# EasyEDA Pro project ProPrj_大功率电调_2026-08-17.epro, board 主控板V1.1
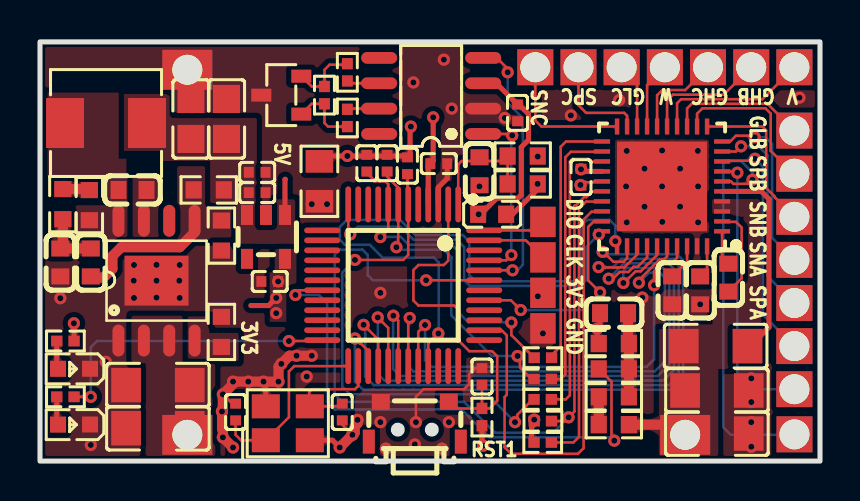
[diagram p21: board, top side]
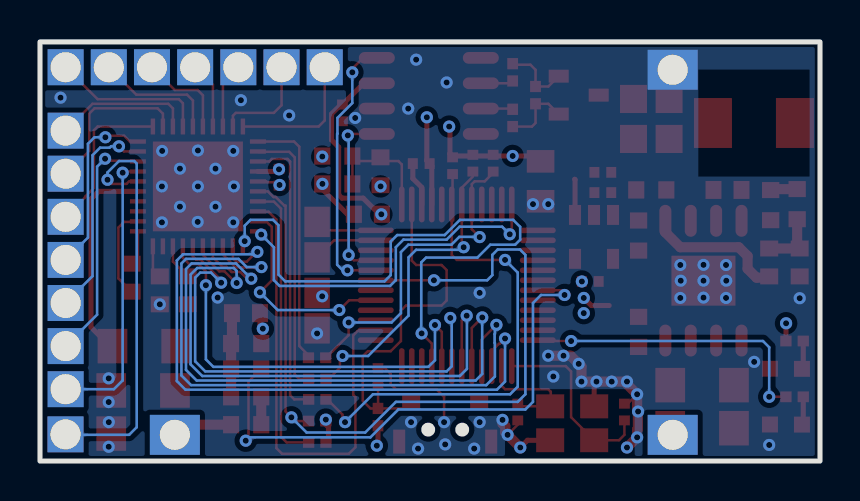
[diagram p22: board, bottom side, seen from below]

Outline 39 x 21 mm; copper layers: Top Layer, Inner1, Inner2, Bottom Layer. Coordinates in mm from the lower left corner of the outline.
Outline path: rectangle 39,21 0,0
Stack: Top Layer 0.035mm Outer layer thickness 1oz / Dielectric1 0.2104mm 7628 RC49% 8.6mil / Inner1 0.0152mm Inner layer thickness / Dielectric2 1.065mm 1.1mm H/HOZ Copper / Inner2 0.0152mm Inner layer thickness / Dielectric3 0.2104mm 7628 RC49% 8.6mil / Bottom Layer 0.035mm Outer layer thickness 1oz

## Design rules (mm)
spacing copperThickness1oz (default): track to track 0.102, other pairs 0.152 to 0.3
spacing copperThickness2oz: track to track 0.203, other pairs 0.152 to 0.3
track width copperThickness1oz (default): min 0.127, default 0.127, max 2.54
track width copperThickness2oz: min 0.203, default 0.254, max 2.54
differential pair differentialPair (default): width min 0.127, default 0.254, max 2.54; gap min 0.152, default 0.152
net VCC_BUS uses copperRegion
net GND uses copperRegion
net $3N8 uses copperRegion
net $3N9 uses copperRegion
net 5V uses copperRegion
net FB uses copperRegion
net 3V3 uses copperRegion
net 3V3_A uses copperRegion
net $1N26 uses copperRegion
net $3N14 uses copperRegion
net VBUS_ADC uses copperRegion

## Placement (name value [footprint] x y rotation side)
C1  47nf  [C0603]  34.42 9.19 90 top
C2  10uF/100v  [C1206]  33.85 1.38 180 top
C3  100nF/100v  [C1206]  33.85 3.54 180 top
C4  1uF  [C1206]  33.78 5.76 0 top
C5  1uf  [C0603]  33.01 8.55 270 top
C6  1uf  [C0603]  31.61 8.55 270 top
C7  1nF  [C0402]  16.34 14.92 270 top
C8  1nF  [C0402]  17.36 14.92 270 top
C9  1nF  [C0402]  18.37 14.8 270 top
C10  2.2nF/50v  [C0603]  4.63 13.58 180 top
C11  22µF/16V  [C0805]  9.33 17.14 270 top
C12  22µF/16V  [C0805]  7.55 17.14 270 top
C13  2.2uf/100v  [C1206]  5.9 3.8 0 top
C14  100nF/100v  [C1206]  5.9 1.65 0 top
C15  3.3nf/50v  [C0603]  1.02 9.95 90 top
C16  56pf/50v  [C0603]  2.54 9.95 90 top
C17  1uF  [C0402]  10.86 14.47 180 top
C18  100nF  [C0402]  10.86 13.45 180 top
C19  1uF  [C0402]  11.49 9 0 top
C20  20pf  [C0402]  9.78 2.46 90 top
C21  100nF  [C0402]  19.94 14.9 180 top
C22  100nF  [C0402]  27.05 14.22 90 top
C28  20pf  [C0402]  15.11 2.46 270 top
C29  100nF  [C0402]  22.1 4.24 270 top
C30  100nF  [C0402]  23.88 17.44 270 top
C32  10nF  [C0603]  28.7 7.41 0 top
C33  100nF  [C0603]  21.98 14.52 90 top
D1  PESD2CAN,215  [SOT-23-3_L2.9-W1.3-P1.90-LS2.4-BR]  12.06 18.33 0 top
L1  33uH  [IND-SMD_L5.4-W5.2]  3.3 16.94 180 top
L2  BLM18PG121SN1D  [L0603]  22.61 12.36 0 top
LED1  -  [LED_0603]  1.65 4.62 180 top
LED2  -  [LED_0603]  1.65 1.82 180 top
NOREF  -  [Pad_e250]  7.37 1.31 90 top
NOREF#2  -  [Pad_e253]  24.77 19.73 90 top
NOREF#3  -  [Pad_e255]  29.08 19.73 90 top
NOREF#4  -  [Pad_e696]  32.26 1.31 90 top
NOREF#5  -  [Pad_e260]  37.72 14.4 180 top
NOREF#6  -  [Pad_e257]  33.4 19.73 90 top
NOREF#7  -  [Pad_e258]  35.56 19.73 90 top
NOREF#8  -  [Pad_e262]  37.72 16.55 180 top
NOREF#9  -  [Pad_e264]  37.72 7.92 180 top
NOREF#10  -  [Pad_e907]  25.15 10.2 270 top
NOREF#11  -  [Pad_e247]  7.37 19.6 270 top
NOREF#12  -  [Pad_e254]  26.92 19.73 90 top
NOREF#13  -  [Pad_e265]  37.72 5.76 180 top
NOREF#14  -  [Pad_e888]  25.15 11.98 270 top
NOREF#15  -  [Pad_e263]  37.72 10.08 180 top
NOREF#16  -  [Pad_e256]  31.24 19.73 90 top
NOREF#17  -  [Pad_e261]  37.72 12.24 180 top
NOREF#18  -  [Pad_e259]  37.72 19.73 90 top
NOREF#19  -  [Pad_e266]  37.72 3.6 180 top
NOREF#20  -  [Pad_e935]  25.15 8.43 270 top
NOREF#21  -  [Pad_e267]  37.72 1.34 180 top
NOREF#22  -  [Pad_e941]  25.15 6.65 270 top
R1  10K  [R0402]  22.1 2.2 90 top
R2  5.1  [R0402]  15.37 17.19 270 top
R3  5.1  [R0402]  15.37 19.48 90 top
R4  120  [R0402]  14.22 18.33 270 top
R5  0  [R0805]  13.97 14.02 270 top
R6  10K  [R0402]  1.27 6.01 180 top
R7  10K  [R0402]  1.27 3.22 180 top
R28  10K  [R0402]  25.14 0.93 0 top
R29  10K  [R0402]  25.14 2 0 top
R30  100  [R0402]  25.14 3.09 0 top
R31  100  [R0402]  25.14 4.11 0 top
R32  100  [R0402]  25.15 5.18 0 top
R33  68K  [R0603]  2.47 12.82 90 top
R34  158k  [R0603]  8.44 13.58 0 top
R35  68K  [R0603]  1.14 12.87 90 top
R36  49.9k  [R0603]  9.07 11.3 90 top
R37  31.6k  [R0603]  9.07 6.47 270 top
R43  100  [R0603]  28.69 4.62 180 top
R47  330K  [R0603]  28.69 1.82 180 top
R48  330K  [R0603]  28.69 3.22 0 top
R49  36K  [R0603]  28.69 5.89 180 top
R51  10k  [R0603]  24.14 13.88 180 top
R52  HNTC0603-103F3950FB  [R0603]  24.14 15.28 0 top
RST1  侧按侧贴开关  [KEY-SMD_1TS003B]  18.74 1.98 0 top
U1  DRV8353SRTAR  [WQFN-40_L6.0-W6.0-P0.50-TL-EP4.5]  31.1 13.76 180 top
U2  LKS32MC071CBT8  [TQFP-48_L7.0-W7.0-P0.50-LS9.0-BL]  18.16 8.81 180 top
U3  LM5164DDAR  [SO-8_L4.9-W3.9-P1.27-LS6.0-BL-EP]  5.83 9.04 0 top
U4  SPX3819-3.3  [SOT-23-5_L2.9-W1.6-P0.95-LS2.8-BL]  11.3 11.23 180 top
U7  TCAN332DR  [SOIC-8_L4.9-W3.9-P1.27-LS6.0-BL]  19.56 18.29 90 top
X1  8MHz  [CRYSTAL-SMD_4P-L3.2-W2.5-BL]  12.39 1.89 0 top

## Footprints (pads in the part's own frame, mm; a bottom-side part is the same pattern mirrored in y, then rotated)
C0402
  rect 0.5x0.54 smd: 1(-0.42,0) 2(0.42,0)
C0603
  rect 0.8x0.9 smd: 1(-0.7,0) 2(0.7,0)
C0805
  rect 1.41x1.35 smd: 1(-1,0) 2(1,0)
C1206
  rect 1.485x1.728 smd: 1(-1.593,0) 2(1.593,0)
CRYSTAL-SMD_4P-L3.2-W2.5-BL
  rect 1.4x1.2 smd: 1(-1.1,-0.85) 2(1.1,-0.85) 3(1.1,0.85) 4(-1.1,0.85)
IND-SMD_L5.4-W5.2
  rect 1.9x2.5 smd: 1(2.05,0) 2(-2.05,0)
KEY-SMD_1TS003B
  rect 0.9x0.8 smd: 1(1.7,1) 2(-1.7,1)
  rect 0.6x1.2 smd: 3(-2.3,-1) 4(2.3,-1)
L0603
  rect 0.8x0.864 smd: 1(-0.7,0) 2(0.7,0)
LED_0603
  rect 0.8x0.8 smd: 1(-0.851,-0.01) 2(0.75,-0.005)
Pad_e247
  rect 2x2.5 hole 1.5: 1(0,0)
Pad_e250
  rect 2x2.5 hole 1.5: 1(0,0)
Pad_e253
  rect 1.8x1.8 hole 1.5: 1(0,0)
Pad_e254
  rect 1.8x1.8 hole 1.5: 1(0,0)
Pad_e255
  rect 1.8x1.8 hole 1.5: 1(0,0)
Pad_e256
  rect 1.8x1.8 hole 1.5: 1(0,0)
Pad_e257
  rect 1.8x1.8 hole 1.5: 1(0,0)
Pad_e258
  rect 1.8x1.8 hole 1.5: 1(0,0)
Pad_e259
  rect 1.8x1.8 hole 1.5: 1(0,0)
Pad_e260
  rect 1.8x1.8 hole 1.5: 1(0,0)
Pad_e261
  rect 1.8x1.8 hole 1.5: 1(0,0)
Pad_e262
  rect 1.8x1.8 hole 1.5: 1(0,0)
Pad_e263
  rect 1.8x1.8 hole 1.5: 1(0,0)
Pad_e264
  rect 1.8x1.8 hole 1.5: 1(0,0)
Pad_e265
  rect 1.8x1.8 hole 1.5: 1(0,0)
Pad_e266
  rect 1.8x1.8 hole 1.5: 1(0,0)
Pad_e267
  rect 1.8x1.8 hole 1.5: 1(0,0)
Pad_e696
  rect 2x2.5 hole 1.5: 1(0,0)
Pad_e888
  rect 1.524x1.27 smd: 1(0,0)
Pad_e907
  rect 1.524x1.27 smd: 1(0,0)
Pad_e935
  rect 1.524x1.27 smd: 1(0,0)
Pad_e941
  rect 1.524x1.27 smd: 1(0,0)
R0402
  rect 0.566x0.54 smd: 1(-0.433,0) 2(0.433,0)
R0603
  rect 0.806x0.864 smd: 1(-0.753,0) 2(0.753,0)
R0805
  rect 1.133x1.377 smd: 1(-1,0) 2(1,0)
SO-8_L4.9-W3.9-P1.27-LS6.0-BL-EP
  oval 0.6x1.6 smd: 1(-1.905,-3) 2(-0.635,-3) 3(0.635,-3) 4(1.905,-3) 5(1.905,3) 6(0.635,3) 7(-0.635,3) 8(-1.905,3)
  rect 3.2x2.5 smd: 9(0,0)
SOIC-8_L4.9-W3.9-P1.27-LS6.0-BL
  oval 0.588x1.8 smd: 1(-1.905,-2.6) 2(-0.635,-2.6) 3(0.635,-2.6) 4(1.905,-2.6) 5(1.905,2.6) 6(0.635,2.6) 7(-0.635,2.6) 8(-1.905,2.6)
SOT-23-3_L2.9-W1.3-P1.90-LS2.4-BR
  rect 1x0.65 smd: 1(1,-0.95) 2(1,0.95) 3(-1,0)
SOT-23-5_L2.9-W1.6-P0.95-LS2.8-BL
  rect 0.6x1 smd: 1(-0.95,-1.1) 2(0,-1.1) 3(0.95,-1.1) 4(0.95,1.1) 5(-0.95,1.1)
TQFP-48_L7.0-W7.0-P0.50-LS9.0-BL
  oval 0.28x1.8 smd: 1(-2.75,-4.05) 2(-2.25,-4.05) 3(-1.75,-4.05) 4(-1.25,-4.05) 5(-0.75,-4.05) 6(-0.25,-4.05) 7(0.25,-4.05) 8(0.75,-4.05) 9(1.25,-4.05) 10(1.75,-4.05) 11(2.25,-4.05) 12(2.75,-4.05) 25(2.75,4.05) 26(2.25,4.05) 27(1.75,4.05) 28(1.25,4.05) 29(0.75,4.05) 30(0.25,4.05) 31(-0.25,4.05) 32(-0.75,4.05) 33(-1.25,4.05) 34(-1.75,4.05) 35(-2.25,4.05) 36(-2.75,4.05)
  oval 1.8x0.28 smd: 13(4.05,-2.75) 14(4.05,-2.25) 15(4.05,-1.75) 16(4.05,-1.25) 17(4.05,-0.75) 18(4.05,-0.25) 19(4.05,0.25) 20(4.05,0.75) 21(4.05,1.25) 22(4.05,1.75) 23(4.05,2.25) 24(4.05,2.75) 37(-4.05,2.75) 38(-4.05,2.25) 39(-4.05,1.75) 40(-4.05,1.25) 41(-4.05,0.75) 42(-4.05,0.25) 43(-4.05,-0.25) 44(-4.05,-0.75) 45(-4.05,-1.25) 46(-4.05,-1.75) 47(-4.05,-2.25) 48(-4.05,-2.75)
WQFN-40_L6.0-W6.0-P0.50-TL-EP4.5
  rect 0.8x0.22 smd: 1(-3,2.25) 2(-3,1.75) 3(-3,1.25) 4(-3,0.75) 5(-3,0.25) 6(-3,-0.25) 7(-3,-0.75) 8(-3,-1.25) 9(-3,-1.75) 10(-3,-2.25) 21(3,-2.25) 22(3,-1.75) 23(3,-1.25) 24(3,-0.75) 25(3,-0.25) 26(3,0.25) 27(3,0.75) 28(3,1.25) 29(3,1.75) 30(3,2.25)
  rect 0.22x0.8 smd: 11(-2.25,-3) 12(-1.75,-3) 13(-1.25,-3) 14(-0.75,-3) 15(-0.25,-3) 16(0.25,-3) 17(0.75,-3) 18(1.25,-3) 19(1.75,-3) 20(2.25,-3) 31(2.25,3) 32(1.75,3) 33(1.25,3) 34(0.75,3) 35(0.25,3) 36(-0.25,3) 37(-0.75,3) 38(-1.25,3) 39(-1.75,3) 40(-2.25,3)
  rect 4.5x4.5 smd: 41(0,0)

## Nets
3V3: C19.2 C30.1 L2.1 NOREF#20.1 R1.1 R6.1 R28.1 R29.1 U4.5 U7.3
3V3_A: C21.2 C22.2 L2.2 R51.1 U1.24 U2.4
5V: C11.2 C12.2 C17.2 C18.2 L1.2 R34.2 U4.1 U4.3
AGND: C7.1 C8.1 C9.1 C22.1 C32.1 C33.1 R5.1 R49.2 R52.2 U1.25
GND: C2.1 C3.1 C5.2 C6.2 C11.1 C12.1 C13.1 C14.1 C15.1 C17.1 C18.1 C19.1 C20.2 C21.1 C28.2 C29.1 C30.2 D1.3 LED1.1 LED2.1 NOREF#11.1 NOREF#22.1 R5.2 R36.1 R37.1 RST1.2 U1.39 U1.41 U2.3 U3.1 U3.9 U4.2 U7.2 X1.2 X1.4
PVCC_BUS: C2.2 C3.2 C4.1 NOREF#4.1 R47.1 U1.3 U1.4
VBUS_ADC: R43.2 U2.19
VCC_BUS: C13.2 C14.2 NOREF.1 U3.2 U3.3
CANH: D1.1 R2.2 R4.2
CANL: D1.2 R3.2 R4.1
ENABLE: U1.31 U2.33
FB: C16.1 R34.1 R36.2 U3.5
GHA: NOREF#21.1 U1.6
GHB: NOREF#7.1 U1.15
GHC: NOREF#6.1 U1.16
GLA: NOREF#13.1 U1.8
GLB: NOREF#8.1 U1.13
GLC: NOREF#3.1 U1.18
INHA: U1.32 U2.27
INHB: U1.34 U2.29
INHC: U1.36 U2.31
INLA: U1.33 U2.28
INLB: U1.35 U2.30
INLC: U1.37 U2.32
LED: R7.1 U2.24
nFAULT: R29.2 U1.26 U2.43
NRST: C29.2 R1.2 RST1.1 U2.2
nSCS: U1.30 U2.12
NTC_ADC: C33.2 R51.2 R52.1 U2.1
OSC_IN: C20.1 U2.25 X1.1
OSC_OUT: C28.1 U2.26 X1.3
RAMP_NODE: C15.2 C16.2 R35.1
RXD: U2.44 U7.4
SCLK: U1.29 U2.41
SD0: U2.37
SDI: U1.28 U2.38
SDO: R28.2 U1.27
SNA: NOREF#15.1 U1.10
SNB: NOREF#17.1 U1.11
SNC: NOREF#2.1 U1.20
SOA: C9.2 R30.1 U2.6
SOB: C8.2 R31.1 U2.7
SOC: C7.2 R32.1 U2.8
SPA: NOREF#9.1 U1.9
SPB: NOREF#5.1 U1.12
SPC: NOREF#12.1 U1.19
SWCLK: NOREF#10.1 U2.47
SWDIO: NOREF#14.1 U2.48
TXD: U2.45 U7.1
U: NOREF#19.1 U1.7
V: NOREF#18.1 U1.14
W: NOREF#16.1 U1.17
$1N4: LED2.2 R7.2
$1N5: LED1.2 R6.2
$1N19: R2.1 U7.7
$1N20: R3.1 U7.6
$1N26: C32.2 R43.1 R48.2 R49.1
$1N27: R47.2 R48.1
$2N6: C6.1 U1.38
$2N8: C5.1 U1.40
$2N26: R32.2 U1.21
$2N27: R31.2 U1.22
$2N28: R30.2 U1.23
$2N30: C4.2 U1.5
$2N42: C1.1 U1.2
$2N43: C1.2 U1.1
$3N3: R33.2 R35.2
$3N8: C10.2 L1.1 R33.1 U3.8
$3N9: C10.1 U3.7
$3N14: R37.2 U3.4

Pads without a net: RST1 3 4; U2 5 9 10 11 13 14 15 16 17 18 20 21 22 23 34 35 36 39 40 42 46; U3 6; U4 4; U7 5 8

## Via types
v1: diameter 0.61, hole 0.305, Top Layer to Bottom Layer, 119 vias

## Routing (per net, layer and track width the routed paths; a pad name or vN(x,y) marks a point on that pad's centre or on a via; arc(x,y) is an arc through that point)
3V3: length 58
  Top Layer w0.127: 24.58,1.69 24.58,1.94 v1(24.71,2.08)
  Top Layer w0.254: 10.54,7.79 11.43,7.79 v1(11.81,8.17) ; 24.58,0.93 24.58,1.69 24.71,1.83 v1(24.71,2.08) ; R1.1 22.1,0.83 v1(22.16,0.77) ; 22.03,12.36 22.84,13.17 23.9,13.17 24.06,13.33 24.06,15.73 24.43,16.09 24.43,17.39 23.95,17.86 C30.1 22.81,18.93 U7.3 ; v1(1.7,6.9) 1.7,6.9 1.7,6.01
  Inner2 w0.254: 22.16,11.22 22.16,8.21 ; 22.16,8.21 22.16,3.6 ; 22.16,8.21 24.85,8.21 v1(24.89,8.25) ; v1(24.71,2.08) 24.71,3.02 24.13,3.6 22.16,3.6 ; 22.16,3.6 v1(22.16,0.77) ; v1(21.93,12.36) 22.16,12.14 22.16,11.22 19.94,11.22 19.22,11.94 12.15,11.94 11.81,11.6 v1(11.81,8.17) v1(11.81,7.41) 2.2,7.41 v1(1.7,6.9)
  vias: v1(11.91,9)
3V3_A: length 23.3
  Top Layer w0.254: R51.1 24.89,13.88 24.89,13.63 23.63,12.36 23.43,12.36 ; v1(27.05,14.62) 27.16,14.51 U1.24 ; v1(19.66,17.22) 19.66,15.04 C21.2 19.41,14.8 U2.4
  Inner2 w0.254: v1(24.88,13.89) 25.61,14.62 v1(27.05,14.62) 27.06,14.6 27.81,14.6 28.07,14.86 28.07,17.65 27.77,17.95 22.48,17.95 21.46,16.94 19.95,16.94 v1(19.66,17.22)
5V: length 1.8
  Top Layer w0.254: U4.1 12.25,14.1 12.27,14.12
AGND: length 9.1
  Top Layer w0.127: 24.89,15.03 24.89,15.03 v1(24.89,15.25) ; v1(27.02,13.83) 27.16,13.97 27.65,13.97 27.69,14.01 U1.25
  Top Layer w0.254: C32.1 28,6.78 v1(27.86,6.63) 27.86,5.97 R49.2 ; 18.37,15.28 v1(15.37,15.28) 14.24,15.28 R5.1 ; 18.5,16.77 18.5,15.4 18.37,15.27
  vias: v1(18.54,16.76) v1(21.97,13.76)
GND: length 22.7
  Top Layer w0.127: v1(9.14,3.35) 9.61,2.88 C20.2 ; C28.2 15.11,1.82 v1(15.62,1.31) ; C29.1 21.76,4.66 21.46,4.36 21.46,3.85 21.21,3.6 19.18,3.6 18.8,3.22 v1(18.8,1.95)
  Top Layer w0.254: 20.36,14.9 20.36,14.16 19.91,13.71 U2.3 ; v1(14.99,0.68) 14.62,1.04 13.49,1.04 ; 11.29,2.74 11.29,3.87 v1(11.18,3.98)
  Top Layer w0.508: v1(15.88,2.06) 15.88,1.88 15.74,1.74 15.74,1.43 v1(15.62,1.31) v1(14.99,0.68) ; v1(9.65,0.68) v1(9.14,1.19) 9.14,1.58 9.1,1.62 9.1,2.46 9.14,2.5 v1(9.14,3.35) 9.78,3.98 v1(10.41,3.98) v1(11.18,3.98) v1(11.93,3.98) 11.93,4.73 v1(12.06,4.87) 12.47,5.28 v1(12.83,5.28) v1(13.59,5.28)
  vias: v1(1.02,8.16) v1(2.54,0.81) v1(3.29,4.97) v1(4.7,9.82) v1(4.69,9.04) v1(4.7,8.17) v1(5.83,9.83) v1(5.83,9.04) v1(5.83,8.19) v1(6.99,9.82) v1(6.96,9.04) v1(6.99,8.17) v1(9.1,2.48) v1(9.65,3.98) v1(13.34,4.24) v1(13.59,12.87) v1(14.35,12.87) v1(17.02,8.43) v1(17.02,1.95) v1(17.29,0.63) v1(18.67,18.97) v1(18.74,0.83) v1(20.1,0.63) v1(20.19,20.11) v1(20.45,1.95) v1(20.59,17.66) v1(23.24,17.19) v1(25.15,6.39) v1(26.54,17.32) v1(28.96,18.08) v1(29.34,15.54) v1(29.3,13.76) v1(29.34,11.96) v1(30.12,8.19) v1(30.23,14.65) v1(30.23,12.74) v1(31.1,15.56) v1(31.1,13.76) v1(31.12,11.98) v1(32,14.65) v1(32,12.74) v1(32.89,15.54) v1(32.9,13.76) v1(32.9,11.96) v1(33.01,7.85) v1(35.56,4.14) v1(35.56,2.96) v1(35.56,1.95) v1(35.56,0.72) v1(37.97,18.21)
PVCC_BUS: length 3.1
  Top Layer w0.508: 32.38,1.38 31.94,1.82 R47.1
VBUS_ADC: length 27.2
  Top Layer w0.127: v1(28.71,1.02) 28.58,1.16 28.58,3.98 R43.2 ; v1(12.77,8.32) 12.77,8.37 12.96,8.56 U2.19
  Bottom Layer w0.127: v1(28.71,1.02) 28.55,1.19 22.48,1.19 21.08,2.58 14.73,2.58 14.35,2.97 14.35,7.92 13.95,8.32 v1(12.77,8.32)
CANH: length 3.6
  Top Layer w0.127: R2.2 14.4,16.76 14.22,16.94 R4.2 13.58,17.9 D1.1
CANL: length 3.5
  Top Layer w0.127: 15.37,19.91 15.32,19.86 14.48,19.86 14.22,19.6 R4.1 13.58,18.77 D1.2
ENABLE: length 31.3
  Top Layer w0.127: U2.33 19.41,5.89 v1(19.92,6.39)
  Bottom Layer w0.127: v1(19.92,6.39) 19.94,6.41 19.94,9.95 19.7,10.19 17.13,10.19 16.48,10.84 15.24,10.84 14.99,11.09 14.99,11.73 15.34,12.08 18,12.08 18.76,11.32 21.14,11.32 21.46,11 21.46,9.32 21.77,9 26.74,9 27.08,9.34 27.08,11.81 27.35,12.08 28.47,12.08 28.77,11.79 v1(28.77,11.02)
FB: length 7.1
  Top Layer w0.508: C16.1 2.6,9.19 3.18,9.19 3.62,9.63 3.62,10.27 4.06,10.71 6.99,10.71 7.73,11.46 U3.5
GHA: length 20.7
  Top Layer w0.127: U1.6 34.55,14.01 34.67,13.89 35.42,13.89 v1(35.62,14.09)
  Bottom Layer w0.127: v1(35.62,14.09) 35.62,14.46 35.05,15.03 34.29,15.03 34.16,14.9 34.16,1.7 34.54,1.31 37.7,1.31 NOREF#21.1
GHB: length 6.2
  Top Layer w0.127: U1.15 31.35,18.06 31.65,18.36 34.19,18.36 NOREF#7.1
GHC: length 4.7
  Top Layer w0.127: NOREF#6.1 32.26,18.59 31.12,18.59 30.85,18.33 U1.16
GLA: length 11.9
  Top Layer w0.127: U1.8 34.13,14.99 34.33,14.99 34.39,15.05 35.65,15.05 v1(35.75,15.15)
  Bottom Layer w0.127: NOREF#13.1 36.15,7.33 36.15,14.75 v1(35.75,15.15)
GLB: length 6.9
  Top Layer w0.127: NOREF#8.1 36.37,17.9 32.59,17.9 32.35,17.67 U1.13
GLC: length 3.3
  Top Layer w0.127: NOREF#3.1 29.85,18.96 U1.18
INHA: length 32.9
  Top Layer w0.127: U2.27 16.41,5.52 16.06,5.87 16.02,5.87 v1(15.75,6.14) ; U1.32 29.35,10.16 29.18,9.99 28.67,9.99 28.17,10.48 v1(28.13,10.48)
  Bottom Layer w0.127: v1(15.75,6.14) 15.75,3.98 16.15,3.58 31.72,3.58 32.16,4.01 32.16,10.05 31.85,10.36 28.34,10.36 28.22,10.48 v1(28.13,10.48)
INHB: length 32.3
  Top Layer w0.127: U1.34 30.35,10.21 29.88,9.73 29.68,9.73 29.42,9.47 28.98,9.47 28.65,9.14 v1(28.44,9.14) ; U2.29 17.41,6.67 v1(16.89,7.2)
  Bottom Layer w0.127: v1(28.44,9.14) 29.2,9.9 31.42,9.9 31.7,9.62 31.7,4.57 31.17,4.03 17.22,4.03 16.89,4.36 16.89,7.19 v1(16.89,7.2)
INHC: length 26.4
  Top Layer w0.127: U2.31 18.41,7.1 v1(18.49,7.17) ; v1(29.94,8.94) 29.94,9.06 30.98,10.1 31.19,10.1 31.35,10.26 U1.36
  Bottom Layer w0.127: v1(18.49,7.17) 18.41,7.1 18.41,4.74 18.67,4.49 30.74,4.49 31.24,5 31.24,9.19 30.99,9.44 30.45,9.44 v1(29.94,8.94)
INLA: length 33.6
  Top Layer w0.127: v1(27.93,9.72) 27.95,9.7 28.88,9.7 28.89,9.7 29.22,9.7 29.85,10.34 U1.33 ; v1(16.18,6.83) 16.91,6.09 U2.28
  Bottom Layer w0.127: v1(16.18,6.83) 16.26,6.75 16.26,6.37 16.27,6.36 16.27,5.92 16.26,5.91 16.26,4.24 16.69,3.8 31.45,3.8 31.93,4.29 31.93,9.9 31.7,10.13 29.07,10.13 28.66,9.72 v1(27.93,9.72)
INLB: length 29.8
  Top Layer w0.127: U2.30 17.91,7.04 v1(17.67,7.28) ; v1(29.17,8.92) 29.19,8.92 29.78,9.5 30.03,9.5 30.85,10.32 U1.35
  Bottom Layer w0.127: v1(17.67,7.28) 17.65,7.27 17.65,4.62 18.01,4.26 30.89,4.26 31.47,4.85 31.47,9.34 31.14,9.67 29.31,9.67 29.17,9.53 v1(29.17,8.92)
INLC: length 22.1
  Top Layer w0.127: U1.37 31.85,10.18 31.54,9.87 31.07,9.87 30.71,9.5 v1(30.71,8.81) ; U2.32 18.91,6.48 v1(19.25,6.82)
  Bottom Layer w0.127: v1(19.25,6.82) 19.25,5.05 19.58,4.72 30.33,4.72 30.71,5.1 v1(30.71,8.81)
LED: length 15
  Top Layer w0.127: U2.24 14.07,6.01 v1(12.45,6.01) ; v1(2.54,3.22) 1.7,3.22
  Bottom Layer w0.127: v1(12.45,6.01) 2.85,6.01 2.54,5.7 v1(2.54,3.22)
NFAULT: length 32.7
  Top Layer w0.127: 26.72,2.48 26.72,12.8 26.78,12.8 27.21,13.23 ; 27.33,13.23 27.61,13.51 28.1,13.51 ; 25.45,2 26.24,2 26.43,2.19
  Bottom Layer w0.127: 14.73,10.33 14.73,3.35 15.11,2.97 21.2,2.97 22.74,1.43 25.67,1.43 26.43,2.19
nFAULT: length 9.3
  Top Layer w0.127: U2.43 v1(19.3,9.06) ; 27.33,13.23 27.21,13.23 ; 26.72,2.48 v1(26.43,2.19)
  Bottom Layer w0.127: 14.73,10.33 15,10.6 16.12,10.6 16.38,10.33 16.38,9.32 16.64,9.06 v1(19.3,9.06)
NRST: length 18.4
  Top Layer w0.127: 22.1,2.64 22.48,2.64 22.86,3.02 22.86,5.25 22.61,5.51 21.46,5.51 20.96,6.01 20.96,7.54 20.7,7.79 18.92,7.79 18.67,8.05 18.67,9.57 18.92,9.82 20.19,9.82 20.41,10.04 U2.2 ; 22.1,2.64 20.78,2.64 20.44,2.98 ; 22.1,2.64 22.1,3.56
NSCS: length 16.8
  Bottom Layer w0.127: v1(27.94,11.35) 27.31,10.71 27.31,9.06 27.02,8.78 21.5,8.78 21.21,9.06 21.21,10.71 20.83,11.09 18.67,11.09 18.02,11.74 15.89,11.74 15.51,11.36
nSCS: length 1.5
  Top Layer w0.127: v1(15.51,11.36) 15.41,11.46 U2.12
NTC_ADC: length 5.9
  Top Layer w0.127: U2.1 20.91,14.86 21.08,15.03 23.38,15.03 23.38,15.03 ; 23.38,15.03 23.38,15.15 ; 23.38,15.03 23.38,13.76
OSC_IN: length 9.3
  Top Layer w0.127: C20.1 9.78,1.31 10.05,1.04 11.29,1.04 12.45,2.2 12.45,4.49 12.71,4.76 U2.25
OSC_OUT: length 6
  Top Layer w0.127: C28.1 14.98,2.74 13.49,2.74 13.46,2.77 13.46,3.47 13.59,3.6 15.75,3.6 15.91,3.76 U2.26
RAMP_NODE: length 3
  Top Layer w0.508: C16.2 C15.2 1.14,10.78 R35.1
RXD: length 13.6
  Top Layer w0.127: U7.4 22.84,20.2 23.38,19.66 v1(23.38,19.48) ; U2.44 23.63,9.56
  Bottom Layer w0.127: v1(23.38,19.48) 23.38,17.94 24.13,17.19 24.13,16.4 24.14,16.39 24.14,9.84 23.86,9.56 v1(23.63,9.56)
SCLK: length 10.7
  Top Layer w0.127: v1(28,8.46) 27.41,9.05 27.41,11.73 27.69,12.01 U1.29 ; U2.41 23.54,8.06 v1(24.03,7.57)
  Bottom Layer w0.127: v1(24.03,7.57) 27.11,7.57 v1(28,8.46)
SDI: length 23.6
  Top Layer w0.127: U1.28 28.09,12.49 27.57,12.49 27.18,12.1 27.18,0.65 26.89,0.36 23.56,0.36 23.23,0.69 23.23,3.21 23.34,3.32 23.34,6.3 23.11,6.52 22.25,6.52 U2.38
SDO: length 14.4
  Top Layer w0.127: 25.44,0.93 26.67,0.93 26.95,1.21 26.95,12.64 27.31,13 28.09,13 U1.27
SNA: length 9.1
  Top Layer w0.127: U1.10 34.51,16.01 34.8,16.3 35.65,16.3 v1(35.73,16.22)
  Bottom Layer w0.127: NOREF#15.1 36.6,11.19 36.6,15.89 36.27,16.22 v1(35.73,16.22)
SNB: length 7.9
  Top Layer w0.127: U1.11 36.12,16.76 36.31,16.57 36.31,13.68 36.74,13.25 36.74,13.21 NOREF#17.1
SNC: length 6.9
  Top Layer w0.127: U1.20 25.07,16.76 24.77,17.06 NOREF#2.1
SOA: length 24.2
  Top Layer w0.127: 18.37,14.25 18.37,12.9 U2.6 18.41,10.33 18.16,10.08 v1(15.75,10.08) ; v1(23.75,1.95) 23.88,2.08 23.88,2.33 24.58,3.03 24.58,3.09
  Bottom Layer w0.127: v1(15.75,10.08) 15.11,9.44 15.11,3.73 15.49,3.35 22.35,3.35 v1(23.75,1.95)
SOB: length 15.3
  Top Layer w0.127: 24.58,4.11 24,4.68 24,5.14 v1(23.88,5.27) ; 17.36,14.25 17.91,13.69 U2.7 17.91,10.81 v1(17.82,10.71)
  Bottom Layer w0.127: v1(17.82,10.71) 17.94,10.59 20.19,10.59 20.57,10.2 20.57,7.28 22.59,5.27 v1(23.88,5.27)
SOC: length 16.6
  Top Layer w0.127: R32.1 24.41,5.48 24.4,5.48 23.57,6.31 v1(23.57,6.94) ; v1(17.02,11.22) 17.41,11.61 U2.8 17.41,13.87 17.27,14.02 16.76,14.02 16.34,14.44 C7.2
  Bottom Layer w0.127: v1(23.57,6.94) 21.42,6.94 20.96,7.41 20.96,10.47 20.58,10.84 18.43,10.84 18.03,11.23 17.03,11.23 v1(17.02,11.22)
SPA: length 10.5
  Top Layer w0.127: U1.9 34.79,15.51 v1(35.05,15.77)
  Bottom Layer w0.127: v1(35.05,15.77) 35.45,15.77 35.52,15.7 35.99,15.7 36.37,15.32 36.37,9.26 NOREF#9.1
SPB: length 8.1
  Top Layer w0.127: NOREF#5.1 37.68,14.4 36.54,15.54 36.54,17.41 36.27,17.67 33.12,17.67 32.85,17.41 U1.12
SPC: length 5.1
  Top Layer w0.127: NOREF#12.1 26.92,17.82 27.31,17.44 29.21,17.44 29.35,17.3 U1.19
SWCLK: length 3.3
  Top Layer w0.127: NOREF#10.1 24.29,11.06 U2.47
SWDIO: length 3.1
  Top Layer w0.127: NOREF#14.1 24.72,11.56 U2.48
TXD: length 9
  Top Layer w0.127: U7.1 23.54,16.39 v1(23.61,16.32) ; U2.45 23.31,10.06 v1(23.57,10.32)
  Bottom Layer w0.127: v1(23.57,10.32) 23.57,16.27 v1(23.61,16.32)
U: length 14.2
  Top Layer w0.127: v1(34.87,14.45) 34.8,14.51 U1.7
  Bottom Layer w0.127: NOREF#19.1 35.31,3.6 34.87,4.04 v1(34.87,14.45)
V: length 7.8
  Top Layer w0.127: NOREF#18.1 36.12,18.13 32.05,18.13 31.85,17.93 U1.14
W: length 3.3
  Top Layer w0.127: NOREF#16.1 30.35,18.84 U1.17
$1N4: length 1.4
  Top Layer w0.254: LED2.2 0.84,1.89 R7.2
$1N5: length 1.4
  Top Layer w0.254: LED1.2 0.84,4.69 R6.2
$1N19: length 1.6
  Top Layer w0.127: 15.37,17.62 15.4,17.66 U7.7
$1N20: length 1.6
  Top Layer w0.127: R3.1 15.48,18.93 U7.6
$1N26: length 4.2
  Top Layer w0.508: C32.2 29.4,5.93 R49.1 R43.1 R48.2
$1N27: length 1.4
  Top Layer w0.508: R48.1 R47.2
$2N6: length 1.8
  Top Layer w0.127: U1.38 32.35,9.99 C6.1
$2N8: length 1.6
  Top Layer w0.127: C5.1 33.35,9.6 U1.40
$2N26: length 13
  Top Layer w0.127: 25.45,5.18 26.03,5.76 26.03,15.75 26.3,16.01 U1.21
$2N27: length 13.8
  Top Layer w0.127: U1.22 28.09,15.49 26.54,15.49 26.26,15.21 26.26,4.34 26.03,4.11 25.44,4.11
$2N28: length 14.6
  Top Layer w0.127: U1.23 27.53,15.01 27.41,15.14 26.62,15.14 26.49,15.01 26.49,3.3 26.29,3.09 25.44,3.09
$2N30: length 10.3
  Top Layer w0.254: U1.5 36.06,13.51 36.45,13.13 36.45,6.71 35.5,5.76
$2N42: length 4.6
  Top Layer w0.127: U1.2 34.13,11.98 34.8,11.98 35.08,11.7 35.08,9.15 C1.1
$2N43: length 1.7
  Top Layer w0.127: U1.1 34.1,9.82
$3N3: length 1.3
  Top Layer w0.508: R33.2 2.42,13.62 R35.2

## Copper pours and planes (outline as drawn; the poured copper is in the pictures)
3V3 on Top Layer: 12.82,10.83 12.82,8.46 11.74,8.46 11.74,10.83
3V3 on Top Layer: 11.49,9.45 12.32,9.45 12.32,6.98 11.49,6.98
5V on Top Layer: 6.1,15.03 6.1,18.39 6.48,18.39 6.48,17.32 6.6,17.19 10.84,17.19 10.84,10.75 9.82,10.75 9.82,12.93 8.51,12.93 8.51,15.03
5V on Top Layer: 4.19,18.39 6.35,18.39 6.35,15.54 4.19,15.54
5V on Top Layer: 11.73,13.1 11.73,13.11 12.76,13.11 12.76,10.88 10.77,10.88 10.77,11.7 11.73,11.7
AGND on Inner2: 28.19,13 28.19,5.71 25.91,5.71 25.91,13
AGND on Inner2: 28.07,17.7 28.07,11.35 13.08,11.35 13.08,17.7
GND on Top Layer: 40.39,22.14 40.39,-1.23 -1.65,-1.23 -1.65,22.14
GND on Bottom Layer: 40.39,22.14 40.39,-1.23 -1.65,-1.23 -1.65,22.14
GND on Inner1: 40.39,22.14 40.39,-2.11 -1.4,-2.11 -1.4,22.14
GND on Inner2: 41.53,24.43 41.53,-2.5 -2.29,-2.5 -2.29,24.43
PVCC_BUS on Top Layer: 33.4,12.24 33.4,13.25 35.94,13.25 36.19,13 36.19,6.9 34.67,6.9 34.67,4.62 31.43,4.62 31.43,6.85 33.63,6.85 33.63,7.87 35.18,7.87 35.18,12.24
PVCC_BUS on Top Layer: 33.91,6.62 33.91,0 30.94,0 30.94,6.62
VCC_BUS on Top Layer: 4.57,7.28 7.11,7.28 7.13,7.27 7.13,4.87 8.76,4.87 8.76,0.02 8.74,0 5.28,0 5.28,4.9 4.57,4.9
FB on Top Layer: 6.86,14.9 8.38,14.9 8.41,14.88 8.41,12.68 9.73,12.68 9.73,11.04 9.73,11.04 6.86,11.04
$3N8 on Top Layer: 4.63,11.01 3.33,11.01 3.33,11.25 1.88,11.25 1.78,11.35 1.78,12.82 3.33,12.82 3.33,14.22 4.57,14.22 4.57,11.07
$3N8 on Top Layer: 0.38,18.46 4.33,18.46 4.33,12.96 0.38,12.96
$3N9 on Top Layer: 5.97,14.78 5.97,11.09 4.63,11.09 4.63,14.78
$3N14 on Top Layer: 7.24,5 7.24,7.25 8.46,7.25 8.46,6.42 9.93,6.42 9.93,5

Small or netless copper shapes (teardrops, artwork), in the pictures only: 241 on Top Layer, 44 on Bottom Layer, 18 on Inner2

## Text on the board
Top Silkscreen Layer: SPC | GLC | W | GHC | GHB | 3V3 | 5V | SNC | DIO | CLK | GND | GLB | SPB | SNB | SNA | SPA | V
